# Altium schematic sheet Signal conditioning.SchDoc
size A4; SheetNumber: 7; SheetTotal: 7
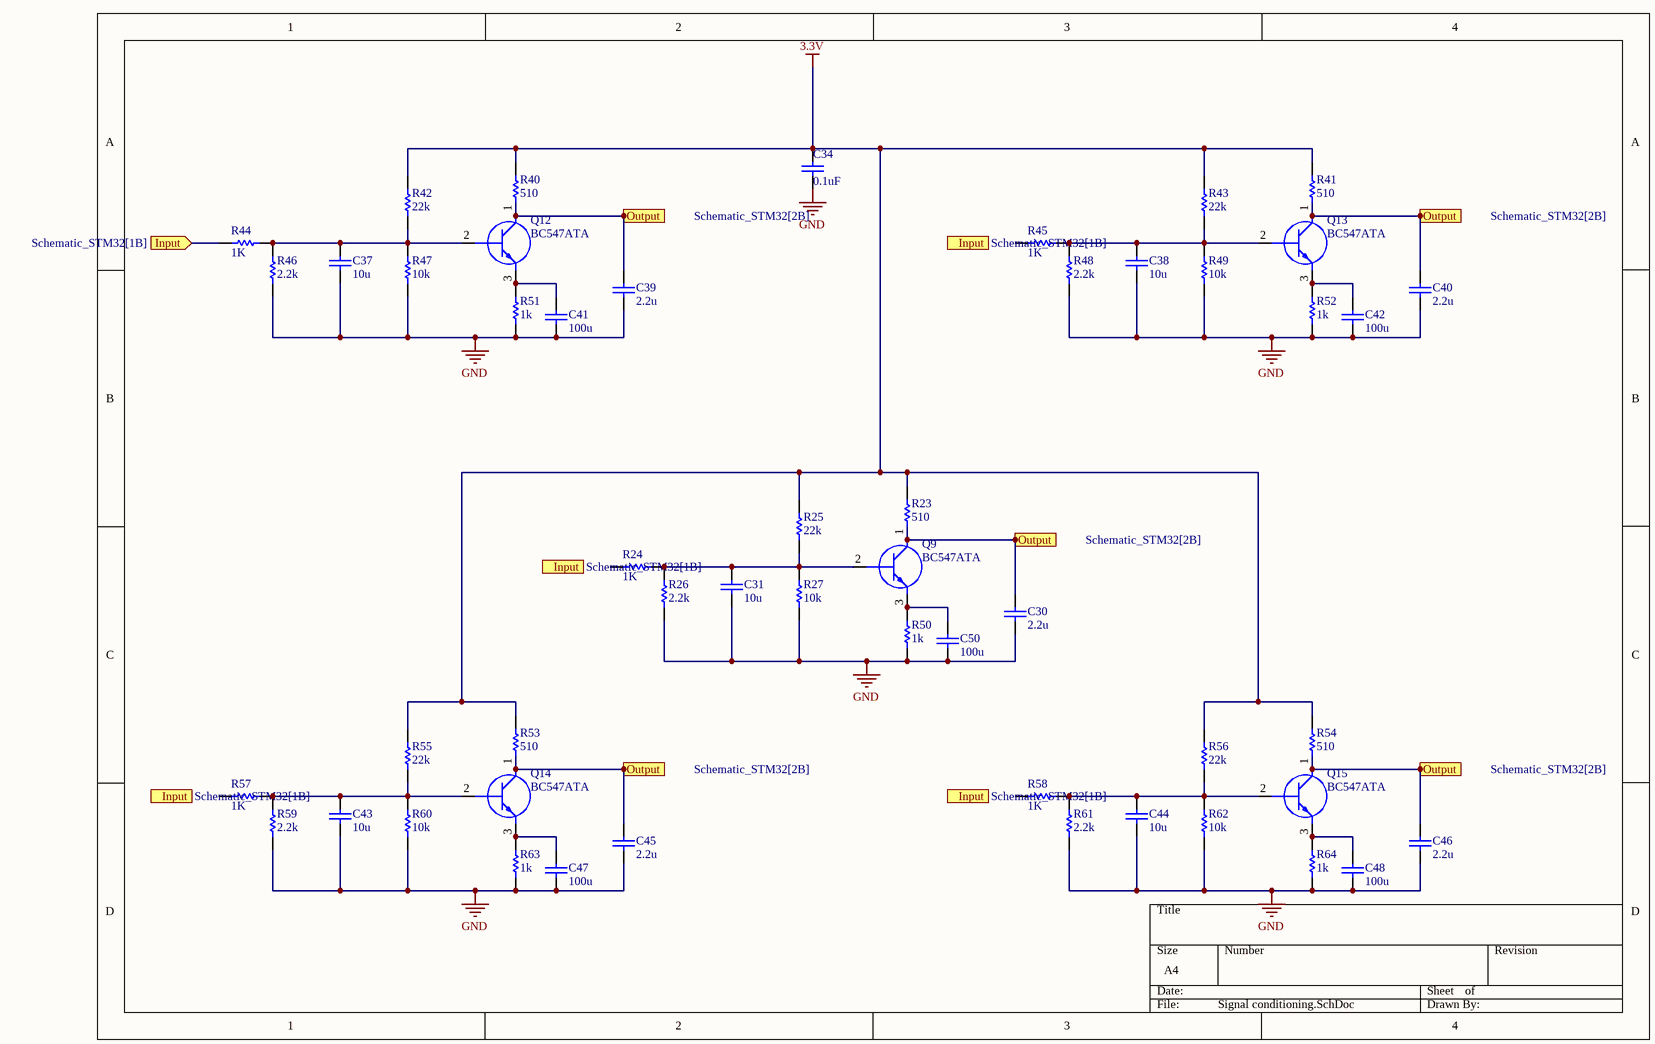
[diagram p0: Signal conditioning.SchDoc]

## Parts
C30  value 2.2u  (hidden comment: Capacitor)
C31  value 10u  (hidden comment: Capacitor)
C34  value 0.1uF  [RAD-0.3]  (hidden comment: Cap)
C37  value 10u  (hidden comment: Capacitor)
C38  value 10u  (hidden comment: Capacitor)
C39  value 2.2u  (hidden comment: Capacitor)
C40  value 2.2u  (hidden comment: Capacitor)
C41  value 100u  (hidden comment: Capacitor)
C42  value 100u  (hidden comment: Capacitor)
C43  value 10u  (hidden comment: Capacitor)
C44  value 10u  (hidden comment: Capacitor)
C45  value 2.2u  (hidden comment: Capacitor)
C46  value 2.2u  (hidden comment: Capacitor)
C47  value 100u  (hidden comment: Capacitor)
C48  value 100u  (hidden comment: Capacitor)
C50  value 100u  (hidden comment: Capacitor)
Q9  BC547ATA  [TO-92_(TO-226)]
Q12  BC547ATA  [TO-92_(TO-226)]
Q13  BC547ATA  [TO-92_(TO-226)]
Q14  BC547ATA  [TO-92_(TO-226)]
Q15  BC547ATA  [TO-92_(TO-226)]
R23  value 510  (hidden comment: Resistor)
R24  value 1K  (hidden comment: Resistor)
R25  value 22k  (hidden comment: Resistor)
R26  value 2.2k  (hidden comment: Resistor)
R27  value 10k  (hidden comment: Resistor)
R40  value 510  (hidden comment: Resistor)
R41  value 510  (hidden comment: Resistor)
R42  value 22k  (hidden comment: Resistor)
R43  value 22k  (hidden comment: Resistor)
R44  value 1K  (hidden comment: Resistor)
R45  value 1K  (hidden comment: Resistor)
R46  value 2.2k  (hidden comment: Resistor)
R47  value 10k  (hidden comment: Resistor)
R48  value 2.2k  (hidden comment: Resistor)
R49  value 10k  (hidden comment: Resistor)
R50  value 1k  (hidden comment: Resistor)
R51  value 1k  (hidden comment: Resistor)
R52  value 1k  (hidden comment: Resistor)
R53  value 510  (hidden comment: Resistor)
R54  value 510  (hidden comment: Resistor)
R55  value 22k  (hidden comment: Resistor)
R56  value 22k  (hidden comment: Resistor)
R57  value 1K  (hidden comment: Resistor)
R58  value 1K  (hidden comment: Resistor)
R59  value 2.2k  (hidden comment: Resistor)
R60  value 10k  (hidden comment: Resistor)
R61  value 2.2k  (hidden comment: Resistor)
R62  value 10k  (hidden comment: Resistor)
R63  value 1k  (hidden comment: Resistor)
R64  value 1k  (hidden comment: Resistor)

## Ports
Input (in, see Schematic_STM32[1B]), Output (out, see Schematic_STM32[2B])

## Nets
3.3V: C34.2 R23.2 R25.2 R40.2 R41.2 R42.2 R43.2 R53.2 R54.2 R55.2 R56.2
GND: C30.2 C31.2 C34.1 C37.2 C38.2 C39.2 C40.2 C41.1 C42.1 C43.2 C44.2 C45.2 C46.2 C47.1 C48.1 C50.1 R26.1 R27.1 R46.1 R47.1 R48.1 R49.1 R50.1 R51.1 R52.1 R59.1 R60.1 R61.1 R62.1 R63.1 R64.1
Input: R44.1 ; port Input
Output: C30.1 C39.1 C40.1 C45.1 C46.1 Q9.1(C) Q12.1(C) Q13.1(C) Q14.1(C) Q15.1(C) R23.1 R40.1 R41.1 R53.1 R54.1 ; port Output
NetC31_1: C31.1 Q9.2(B) R24.2 R25.1 R26.2 R27.2
NetC37_1: C37.1 Q12.2(B) R42.1 R44.2 R46.2 R47.2
NetC38_1: C38.1 Q13.2(B) R43.1 R45.2 R48.2 R49.2
NetC41_2: C41.2 Q12.3(E) R51.2
NetC42_2: C42.2 Q13.3(E) R52.2
NetC43_1: C43.1 Q14.2(B) R55.1 R57.2 R59.2 R60.2
NetC44_1: C44.1 Q15.2(B) R56.1 R58.2 R61.2 R62.2
NetC47_2: C47.2 Q14.3(E) R63.2
NetC48_2: C48.2 Q15.3(E) R64.2
NetC50_2: C50.2 Q9.3(E) R50.2

Not connected (* = marked no-connect by the designer): R24 1; R45 1; R57 1; R58 1

## Library data of the parts
C30 C31 C37-C48 C50 = Capacitor: SimulationGenericComponent: True
C34 = Cap: Capacitor; Published: 8-Jun-2000; LatestRevisionDate: 17-Jul-2002; LatestRevisionNote: Re-released for DXP Platform.; PackageReference: RAD-0.3; Publisher: Altium Limited; PackageDescription: Radial Cap, Thru-Hole; 2 Leads; 0.3 in Pin Spacing
Q9 Q12-Q15 = BC547ATA: Transistor BJT NPN; Manufacturer_Name: onsemi; Datasheet Link: https://www.onsemi.com/pub/Collateral/BC550-D.pdf; Manufacturer_Part_Number: BC547ATA; Mouser Part Number: 512-BC547ATA; Mouser Price/Stock: https://www.mouser.co.uk/ProductDetail/onsemi-Fairchild/BC547ATA?qs=ljbEvF4DwOMRdLfuzO8N4w%3D%3D; Arrow Part Number: BC547ATA; Arrow Price/Stock: https://www.arrow.com/en/products/bc547ata/on-semiconductor?region=europe
R23-R27 R40-R64 = Resistor: TC1: 0; SimulationGenericComponent: True; TC2: 0